# Altium schematic sheet 103+OLED原理图.SCHDOC
size A2
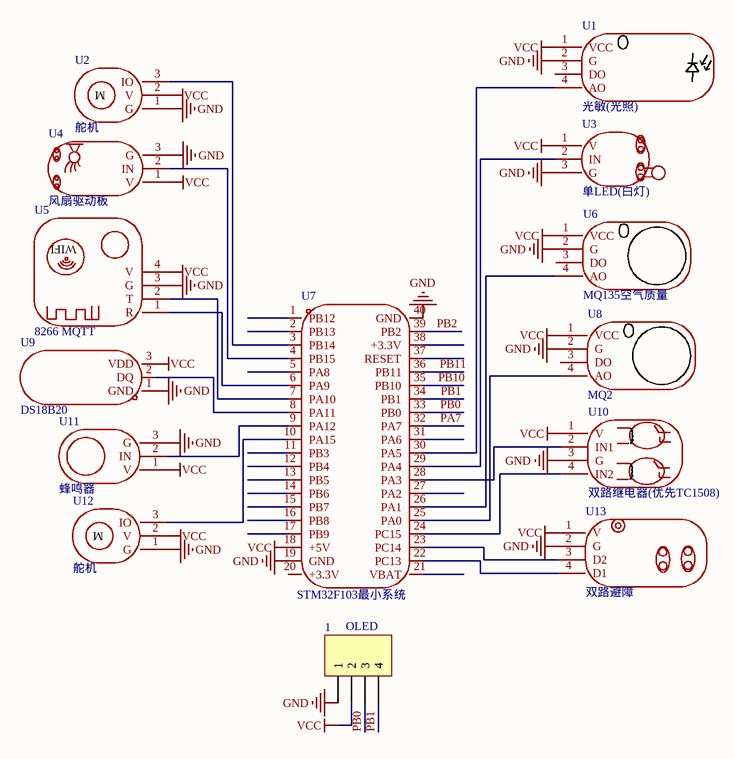
[diagram p0: 103+OLED原理图.SCHDOC]

## Parts
1  OLED  [HDR1X4]
U1  光敏(光照)  [HDR1X4]
U2  舵机  [HDR1X3]
U3  单LED(白灯)
U4  风扇驱动板  [HDR1X3]
U5  8266 MQTT  [HDR1X4]
U6  MQ135空气质量
U7  STM32F103最小系统
U8  MQ2  [HDR1X4]
U9  DS18B20  [HDR1X3]
U10  双路继电器(优先TC1508)
U11  蜂鸣器  [HDR1X3]
U12  舵机  [HDR1X3]
U13  双路避障  [HDR1X4]

## Nets
GND: 1.1 U1.2(G) U2.1(G) U3.3(G) U4.3(G) U5.3(G) U6.2(G) U7.19(GND) U7.40(GND) U8.2(G) U9.1(GND) U10.3(G) U11.3(G) U12.1(G) U13.2(G)
VCC: 1.2 U1.1(VCC) U2.2(V) U3.1(V) U4.1(V) U5.4(V) U6.1(VCC) U7.18(+5V) U8.1(VCC) U9.3(VDD) U10.1(V) U11.1(V) U12.2(V) U13.1(V)
PA7: U7.32(PA7)
PB0: 1.3 U7.33(PB0)
PB1: 1.4 U7.34(PB1)
PB2: U7.39(PB2)
PB10: U7.35(PB10)
PB11: U7.36(PB11)
NetU1_4: U1.4(AO) U7.30(PA5)
NetU2_3: U2.3(IO) U7.3(PB14)
NetU3_2: U3.2(IN) U7.29(PA4)
NetU4_2: U4.2(IN) U7.4(PB15)
NetU5_1: U5.1(R) U7.6(PA9)
NetU5_2: U5.2(T) U7.7(PA10)
NetU6_4: U6.4(AO) U7.26(PA1)
NetU7_8: U7.8(PA11) U9.2(DQ)
NetU7_9: U7.9(PA12) U11.2(IN)
NetU7_10: U7.10(PA15) U12.3(IO)
NetU7_22: U7.22(PC13) U13.4(D1)
NetU7_23: U7.23(PC14) U13.3(D2)
NetU7_24: U7.24(PC15) U10.4(IN2)
NetU7_25: U7.25(PA0) U8.4(AO)
NetU7_28: U7.28(PA3) U10.2(IN1)

Not connected (* = marked no-connect by the designer): U1 3(DO); U6 3(DO); U7 1(PB12) 2(PB13) 5(PA8) 11(PB3) 12(PB4) 13(PB5) 14(PB6) 15(PB7) 16(PB8) 17(PB9) 20(+3.3V) 21(VBAT) 27(PA2) 31(PA6) 37(RESET) 38(+3.3V); U8 3(DO)

## Notes on the sheet
- (in symbol 8266 MQTT) WIFI
- (in symbol 舵机) M

## Library data of the parts
1 = Header 4: Header, 4-Pin; LatestRevisionDate: 17-Jul-2002; LatestRevisionNote: Re-released for DXP Platform.; Publisher: Altium Limited
U1 = 光敏(光照): NCH
U2 U12 = 舵机: NBI
U3 = 单LED(白灯): NBC
U4 = 风扇驱动板: NCI
U5 = 8266 MQTT: NCB
U6 = MQ135空气质量: NAZM
U7 = LCKFB-DKX-STM32F103C8T6: Add into BOM: yes; Symbol: LCKFB-DKX-STM32F103C8T6; Device: LCKFB-DKX-STM32F103C8T6; Supplier Part: C22396880; Manufacturer Part: LCKFB-DKX-STM32F103C8T6; Supplier Footprint: -; Datasheet: https://atta.szlcsc.com/upload/public/pdf/source/20240801/7EEF69F7480DF7C6DA98696664D658D4.pdf; Supplier: LCSC; Convert to PCB: yes; Comment_1: LCKFB-DKX-STM32F103C8T6
U8 = MQ2: NBE
U9 = DS18B20: NBM
U10 = 双路继电器(优先TC1508): NCG
U11 = 蜂鸣器: NCD
U13 = 双路避障: NCL